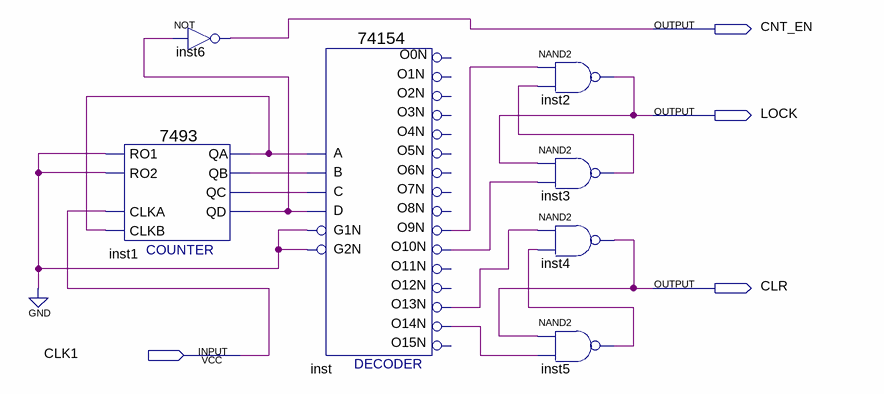
[diagram p0: schematic sheet]
// Quartus schematic TF_CTRL.bdf as structural Verilog: 7 symbols, 4 pins
module TF_CTRL (
  input  CLK1,
  output CNT_EN,
  output LOCK,
  output CLR
);

  wire inst1_qa, inst1_qb, inst1_qc, inst1_qd, inst3_out, inst5_out, inst_o9n, inst_o10n, inst_o13n,
       inst_o14n;

  \7493  inst1 (
    .RO1(1'b0), .RO2(1'b0), .CLKA(CLK1), .CLKB(inst1_qa), .QC(inst1_qc), .QB(inst1_qb), .QA(inst1_qa),
    .QD(inst1_qd));
  not inst6 (CNT_EN, inst1_qd);
  \74154  inst (
    .C(inst1_qc), .D(inst1_qd), .B(inst1_qb), .A(inst1_qa), .G1N(1'b0), .G2N(1'b0), .O10N(inst_o10n),
    .O13N(inst_o13n), .O14N(inst_o14n), .O9N(inst_o9n));  // open: O0N, O12N, O15N, O11N, O1N, O4N, O3N, O2N, O7N, O6N, O5N, O8N
  nand inst2 (LOCK, inst_o9n, inst3_out);
  nand inst3 (inst3_out, LOCK, inst_o10n);
  nand inst4 (CLR, inst_o13n, inst5_out);
  nand inst5 (inst5_out, CLR, inst_o14n);
endmodule
